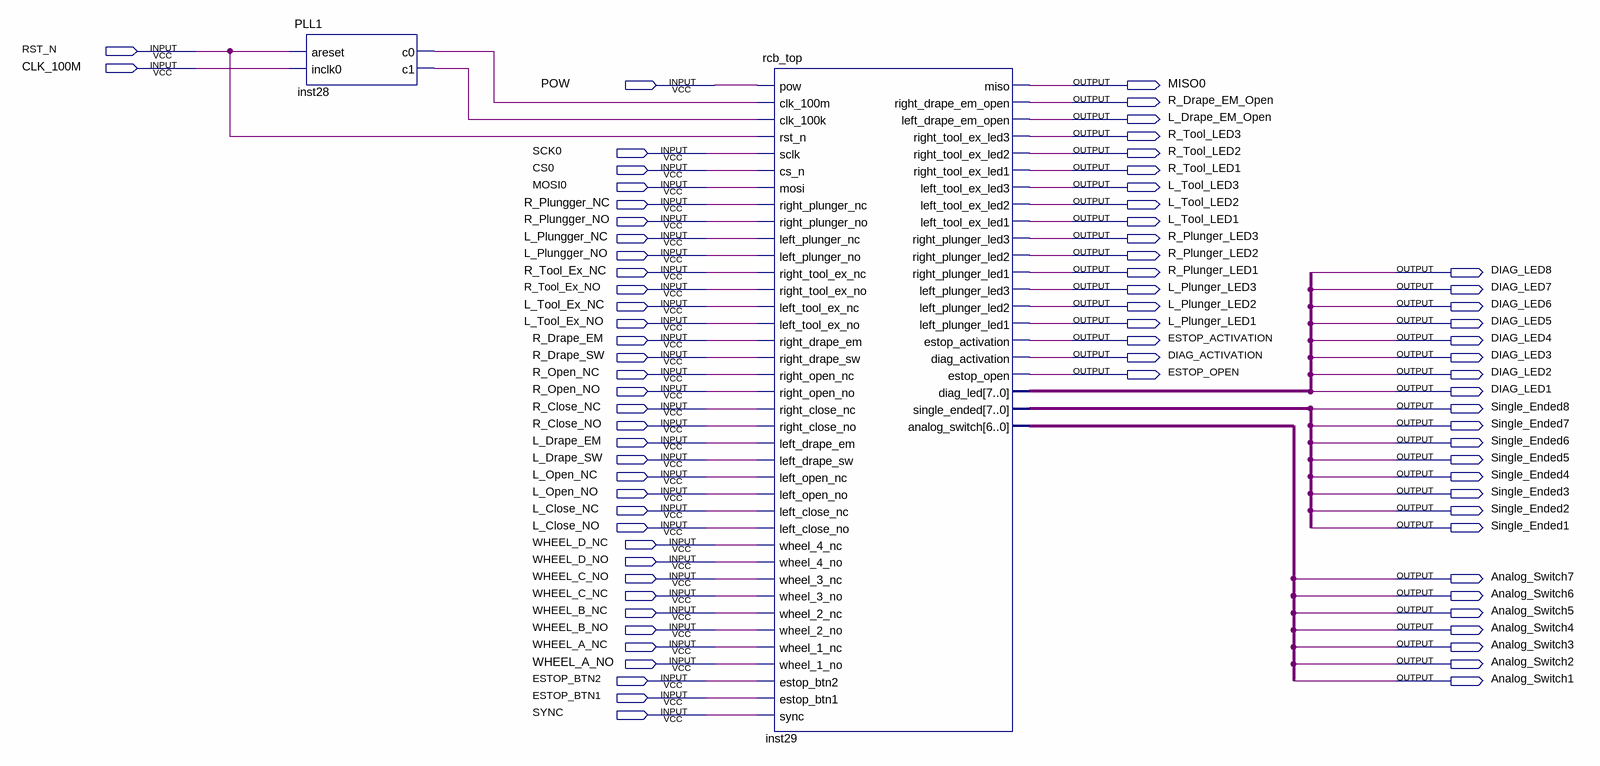
[diagram p0: schematic sheet]
// Quartus schematic RCB_FPGA.bdf as structural Verilog: 2 symbols, 78 pins
module RCB_FPGA (
  input  RST_N,
  input  CLK_100M,
  input  POW,
  input  SCK0,
  input  CS0,
  input  MOSI0,
  input  R_Plungger_NC,
  input  R_Plungger_NO,
  input  L_Plungger_NC,
  input  L_Plungger_NO,
  input  R_Tool_Ex_NC,
  input  R_Tool_Ex_NO,
  input  L_Tool_Ex_NC,
  input  L_Tool_Ex_NO,
  input  R_Drape_EM,
  input  R_Drape_SW,
  input  R_Open_NC,
  input  R_Open_NO,
  input  R_Close_NC,
  input  R_Close_NO,
  input  L_Drape_EM,
  input  L_Drape_SW,
  input  L_Open_NC,
  input  L_Open_NO,
  input  L_Close_NC,
  input  L_Close_NO,
  input  WHEEL_D_NC,
  input  WHEEL_D_NO,
  input  WHEEL_C_NO,
  input  WHEEL_C_NC,
  input  WHEEL_B_NC,
  input  WHEEL_B_NO,
  input  WHEEL_A_NC,
  input  WHEEL_A_NO,
  input  ESTOP_BTN2,
  input  ESTOP_BTN1,
  input  SYNC,
  output MISO0,
  output R_Drape_EM_Open,
  output L_Drape_EM_Open,
  output R_Tool_LED3,
  output R_Tool_LED2,
  output R_Tool_LED1,
  output L_Tool_LED3,
  output L_Tool_LED2,
  output L_Tool_LED1,
  output R_Plunger_LED3,
  output R_Plunger_LED2,
  output R_Plunger_LED1,
  output DIAG_LED8,
  output L_Plunger_LED3,
  output DIAG_LED7,
  output L_Plunger_LED2,
  output DIAG_LED6,
  output L_Plunger_LED1,
  output DIAG_LED5,
  output ESTOP_ACTIVATION,
  output DIAG_LED4,
  output DIAG_ACTIVATION,
  output DIAG_LED3,
  output ESTOP_OPEN,
  output DIAG_LED2,
  output DIAG_LED1,
  output Single_Ended8,
  output Single_Ended7,
  output Single_Ended6,
  output Single_Ended5,
  output Single_Ended4,
  output Single_Ended3,
  output Single_Ended2,
  output Single_Ended1,
  output Analog_Switch7,
  output Analog_Switch6,
  output Analog_Switch5,
  output Analog_Switch4,
  output Analog_Switch3,
  output Analog_Switch2,
  output Analog_Switch1
);

  wire inst28_c0, inst28_c1;

  PLL1 inst28 (.areset(RST_N), .inclk0(CLK_100M), .c0(inst28_c0), .c1(inst28_c1));
  rcb_top inst29 (
    .pow(POW), .clk_100m(inst28_c0), .clk_100k(inst28_c1), .rst_n(RST_N), .sclk(SCK0), .cs_n(CS0),
    .mosi(MOSI0), .right_plunger_nc(R_Plungger_NC), .right_plunger_no(R_Plungger_NO),
    .left_plunger_nc(L_Plungger_NC), .left_plunger_no(L_Plungger_NO), .right_tool_ex_nc(R_Tool_Ex_NC),
    .right_tool_ex_no(R_Tool_Ex_NO), .left_tool_ex_nc(L_Tool_Ex_NC), .left_tool_ex_no(L_Tool_Ex_NO),
    .right_drape_em(R_Drape_EM), .right_drape_sw(R_Drape_SW), .right_open_nc(R_Open_NC),
    .right_open_no(R_Open_NO), .right_close_nc(R_Close_NC), .right_close_no(R_Close_NO),
    .left_drape_em(L_Drape_EM), .left_drape_sw(L_Drape_SW), .left_open_nc(L_Open_NC),
    .left_open_no(L_Open_NO), .left_close_nc(L_Close_NC), .left_close_no(L_Close_NO),
    .wheel_4_nc(WHEEL_D_NC), .wheel_4_no(WHEEL_D_NO), .wheel_3_nc(WHEEL_C_NO), .wheel_3_no(WHEEL_C_NC),
    .wheel_2_nc(WHEEL_B_NC), .wheel_2_no(WHEEL_B_NO), .wheel_1_nc(WHEEL_A_NC), .wheel_1_no(WHEEL_A_NO),
    .estop_btn2(ESTOP_BTN2), .estop_btn1(ESTOP_BTN1), .sync(SYNC), .miso(MISO0),
    .right_drape_em_open(R_Drape_EM_Open), .left_drape_em_open(L_Drape_EM_Open),
    .right_tool_ex_led3(R_Tool_LED3), .right_tool_ex_led2(R_Tool_LED2), .right_tool_ex_led1(R_Tool_LED1),
    .left_tool_ex_led3(L_Tool_LED3), .left_tool_ex_led2(L_Tool_LED2), .left_tool_ex_led1(L_Tool_LED1),
    .right_plunger_led3(R_Plunger_LED3), .right_plunger_led2(R_Plunger_LED2),
    .right_plunger_led1(R_Plunger_LED1), .left_plunger_led3(L_Plunger_LED3),
    .left_plunger_led2(L_Plunger_LED2), .left_plunger_led1(L_Plunger_LED1),
    .estop_activation(ESTOP_ACTIVATION), .diag_activation(DIAG_ACTIVATION), .estop_open(ESTOP_OPEN),
    .diag_led({DIAG_LED8, DIAG_LED7, DIAG_LED6, DIAG_LED5, DIAG_LED4, DIAG_LED3, DIAG_LED2, DIAG_LED1}),
    .single_ended({Single_Ended8, Single_Ended7, Single_Ended6, Single_Ended5, Single_Ended4, Single_Ended3, Single_Ended2, Single_Ended1}),
    .analog_switch({Analog_Switch7, Analog_Switch6, Analog_Switch5, Analog_Switch4, Analog_Switch3, Analog_Switch2, Analog_Switch1}));
endmodule
